# EAGLE design Esquema control remoto (EAGLE 7.3.0)
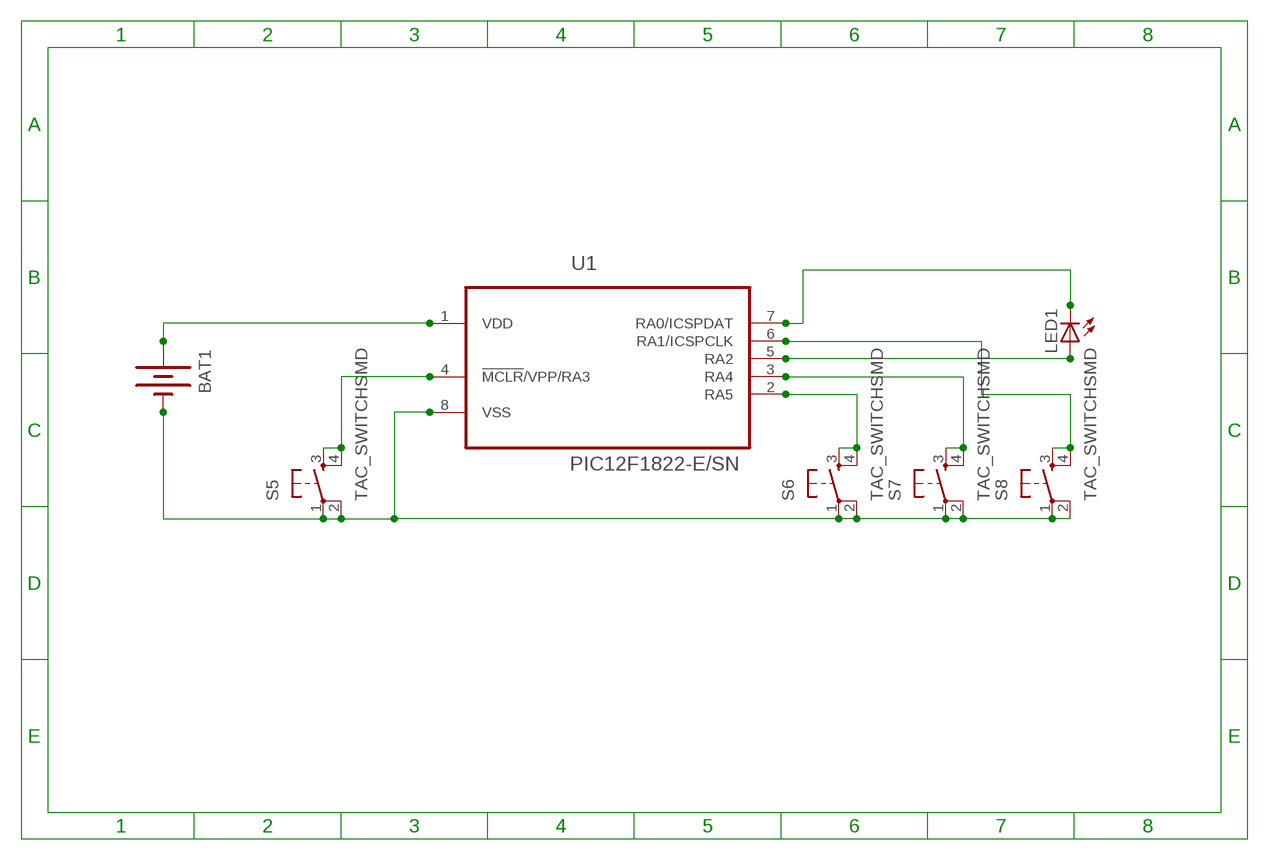
[diagram p0: schematic, sheet 1]

## Parts
BAT1  BATTERY20SMD  [BATTCON_20MM]
LED1  LEDCHIPLED_1206  [CHIPLED_1206]
S5  TAC_SWITCHSMD  [TACTILE-SWITCH-SMD]
S6  TAC_SWITCHSMD  [TACTILE-SWITCH-SMD]
S7  TAC_SWITCHSMD  [TACTILE-SWITCH-SMD]
S8  TAC_SWITCHSMD  [TACTILE-SWITCH-SMD]
U1  PIC12F1822-E/SN  [SOIC127P600X175-8N]

## Nets
N$1: LED1.C U1.7(RA0/ICSPDAT)
N$2: LED1.A U1.5(RA2)
N$3: S5.3 S5.4 U1.4(!MCLR!/VPP/RA3)
N$4: S6.3 S6.4 U1.2(RA5)
N$5: S7.3 S7.4 U1.3(RA4)
N$6: S8.3 S8.4 U1.6(RA1/ICSPCLK)
N$7: BAT1.2(-) S5.1 S5.2 S6.1 S6.2 S7.1 S7.2 S8.1 S8.2 U1.8(VSS)
N$8: BAT1.1(+) U1.1(VDD)

## Library data of the parts
BAT1 = SparkFun-Electromechanical:BATTERY: Battery Holders Various common sizes : AA, AAA, 18650 (PRT-12895), 20mm coin cell and 12mm coin cell. 20MM_4LEGS, BATT-10373
LED1 = adafruit:LED: LED OSRAM: - CHIPLED LG R971, LG N971, LY N971, LG Q971, LY Q971, LO R971, LY R971 LH N974, LH R974 LS Q976, LO Q976, LY Q976 LO Q996 - Hyper CHIPLED LW Q18S LB Q993, LB Q99A, LB R99A - SideLED LS A670, LO A670, LY A670, LG A670, LP A670 LB A673, LV A673, LT A673, LW A673 LH A674 LY A675 LS A676, LA A676, LO A676, LY A676, LW A676 LS A679, LY A679, LG A679 - Hyper Micro SIDELED® LS Y876, LA Y876, LO Y876, LY Y876 LT Y87S - SmartLED LW L88C, LW L88S LB L89C, LB L89S, LG L890 LS L89K, LO L89K, LY L89K LS L896, LA L896, LO L896, LY L896 - TOPLED LS T670, LO T670, LY T670, LG T670, LP T670 LSG T670, LSP T670, LSY T670, LOP T670, LYG T670 LG T671, LOG T671, LSG T671 LB T673, LV T673, LT T673, LW T673 LH T674 LS T676, LA T676, LO T676, LY T676, LB T676, LH T676, LSB T676, LW T676 LB T67C, LV T67C, LT T67C, LS T67K, LO T67K, LY T67K, LW E67C LS E67B, LA E67B, LO E67B, LY E67B, LB E67C, LV E67C, LT E67C LW T67C LS T679, LY T679, LG T679 LS T770, LO T770, LY T770, LG T770, LP T770 LB T773, LV T773, LT T773, LW T773 LH T774 LS E675, LA E675, LY E675, LS T675 LS T776, LA T776, LO T776, LY T776, LB T776 LHGB T686 LT T68C, LB T68C - Hyper Mini TOPLED® LB M676 - Mini TOPLED Santana® LG M470 LS M47K, LO M47K, LY M47K Source: http://www.osram.convergy.de/
S5-S8 = SparkFun-Retired:TAC_SWITCH: Momentary Switch Button commonly used for reset or general input. Spark Fun Electronics SKU : COM-00097 SMT- SWCH-08247; PROD_ID: SWCH-08247
U1 = Microchip-PIC12F1822-E_SN:PIC12F1822-E/SN: 8/14-Pin Flash Microcontrollers,SOIC-8; MPN: PIC12F1822-E/SN; OC_FARNELL: 2315760; OC_NEWARK: 53R0195; PACKAGE: SOIC-8; SUPPLIER: Microchip

## Board
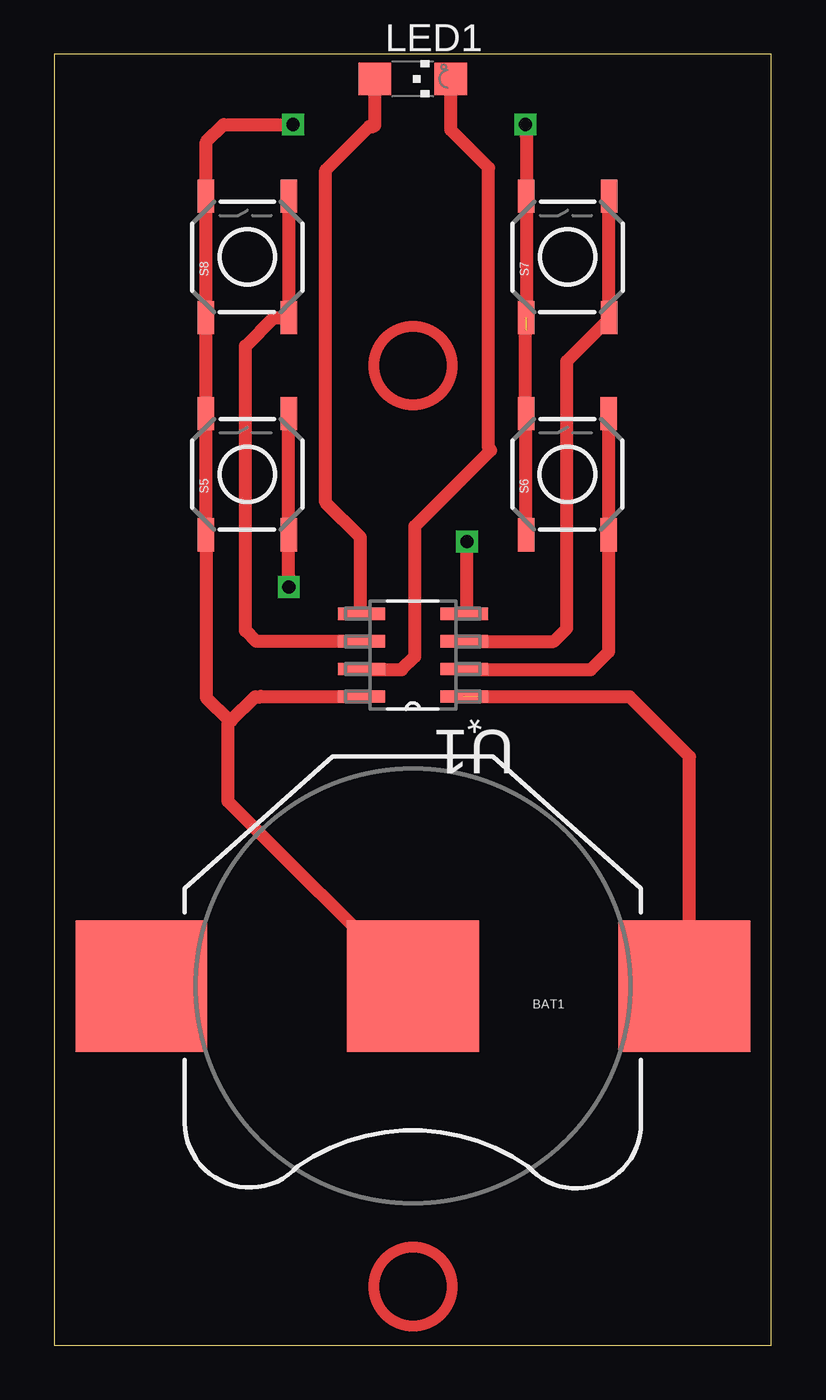
[diagram p1: board, top side]
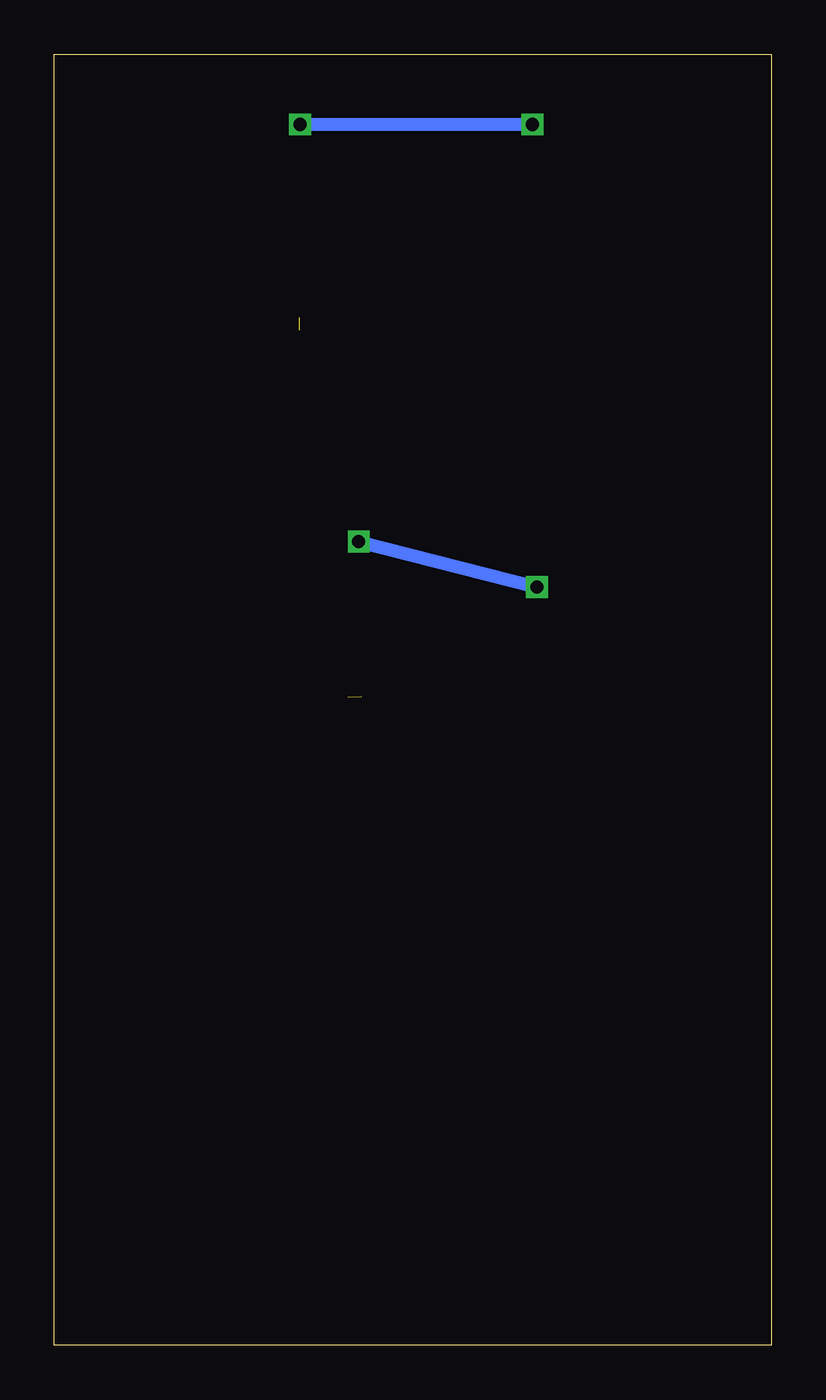
[diagram p2: board, bottom side, seen from below]

Size 33.02 x 59.43 mm. Coordinates in mm from the lower left corner, seen from the top.
Outline: 0,0 33.02,0 33.02,59.43 0,59.43 0,0
Copper layers (1*16): Top 0.035mm / dielectric 1.5mm / Bottom 0.035mm
Design rules "default": minimum track width 10mil, minimum drill 24mil, track to track 8mil, track to pad 8mil, pad to pad 8mil, via to via 8mil, smd to smd 8mil, copper to edge 40mil, drill to drill 8mil, minimum pad ring 10mil, minimum via ring 8mil, stop-mask expansion 4mil, vias tented up to drill 0mil, thermal gap 10mil

### Footprints (pad centres in the part's own frame; a part is rotated, then mirrored left to right if it is on the bottom)
BATTCON_20MM = smd 6.07 x 6.07: 1 -12.5,0; 2 0,0; 3 12.5,0
CHIPLED_1206 = smd 1.5 x 1.5: A 0,-1.75; C 0,1.75
TACTILE-SWITCH-SMD = smd 1.524 x 0.762: 1 -2.794,1.905; 2 2.794,1.905; 3 -2.794,-1.905; 4 2.794,-1.905
SOIC127P600X175-8N = smd 2.184 x 0.559: 1 -2.362,1.905; 2 -2.362,0.635; 3 -2.362,-0.635; 4 -2.362,-1.905; 5 2.362,-1.905; 6 2.362,-0.635; 7 2.362,0.635; 8 2.362,1.905

### Placement (x,y rotation side)
BAT1  16.51,16.53 180 top
LED1  16.51,58.3 270 top
S5  8.89,40.1 90 top
S6  23.63,40.1 90 top
S7  23.64,50.1 90 top
S8  8.89,50.1 90 top
U1  16.51,31.77 180 top

### Tracks (layer width: path | path; a pad name or v marks a point on that pad's centre or on a via)
N$1
  Top 0.61: U1.7 14.18,31.1 16,31.1 16.6,31.7 16.6,37.7 20.1,41.2 20,41.3 20,54.2 18.26,55.94 LED1.C
N$2
  Top 0.61: U1.5 14.1,33.72 14.1,37.2 12.5,38.8 12.5,54.1 14.5,56.1 14.7,56.1 14.76,56.16 LED1.A
N$3  (via drill 0.6)
  Top 0.61: S5.4 S5.3 10.79,35.41 v10.8,34.9 | U1.4 19,33.8 v19,37
  Bottom 0.61: v19,37 v10.8,34.9
N$4
  Top 0.61: S6.4 S6.3 25.54,31.93 24.7,31.1 18.91,31.1 U1.2
N$5
  Top 0.61: U1.3 23,32.4 23.6,33 23.6,45.3 25.55,47.24 S7.3 S7.4
N$6
  Top 0.61: U1.6 9.3,32.4 8.8,32.9 8.8,46 10.11,47.31 S8.3 S8.4
N$7  (via drill 0.6)  (1 unrouted)
  Top 0.61: BAT1.2 8,25.04 8,28.6 8.15,28.75 | 8.15,28.75 9.25,29.85 9.5,29.85 9.52,29.86 U1.8 | S6.1 S6.2 21.7,42.92 21.7,46.7 21.73,46.73 | S8.1 S5.2 S5.1 7,37.29 7,29.8 8.05,28.75 8.15,28.75 | S8.1 | 7,52.4 6.99,52.41 S8.2 | 7,52.4 7,55.4 7.8,56.2 v11,56.2 | v21.7,56.2 21.73,55.66 S7.2 S7.1 | S8.1 7,52.4
  Bottom 0.61: v11,56.2 v21.7,56.2
N$8  (1 unrouted)
  Top 0.61: BAT1.1 29.25,16.77 29.25,27.1 26.5,29.85 19.5,29.85
(copper drawn outside any net)
  shapes: Top circle x2